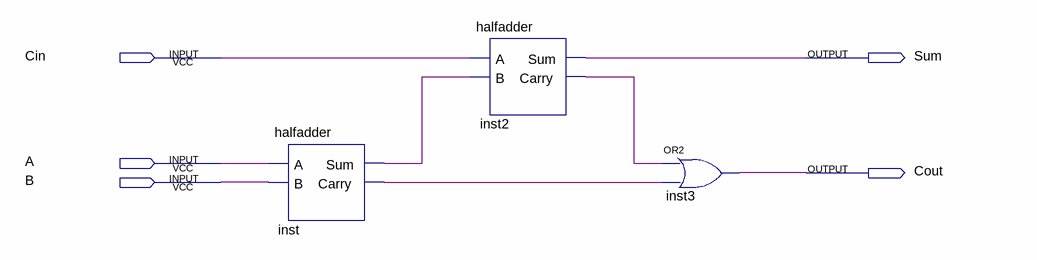
[diagram p0: schematic sheet]
// Quartus schematic fulladder.bdf as structural Verilog: 3 symbols, 5 pins
module fulladder (
  input  Cin,
  input  A,
  input  B,
  output Sum,
  output Cout
);

  wire inst2_carry, inst_carry, inst_sum;

  halfadder inst (.A(A), .B(B), .Sum(inst_sum), .Carry(inst_carry));
  halfadder inst2 (.A(Cin), .B(inst_sum), .Sum(Sum), .Carry(inst2_carry));
  or inst3 (Cout, inst2_carry, inst_carry);
endmodule
